# EAGLE design LoRa Mini Dev v1.3 (EAGLE 7.5.0)
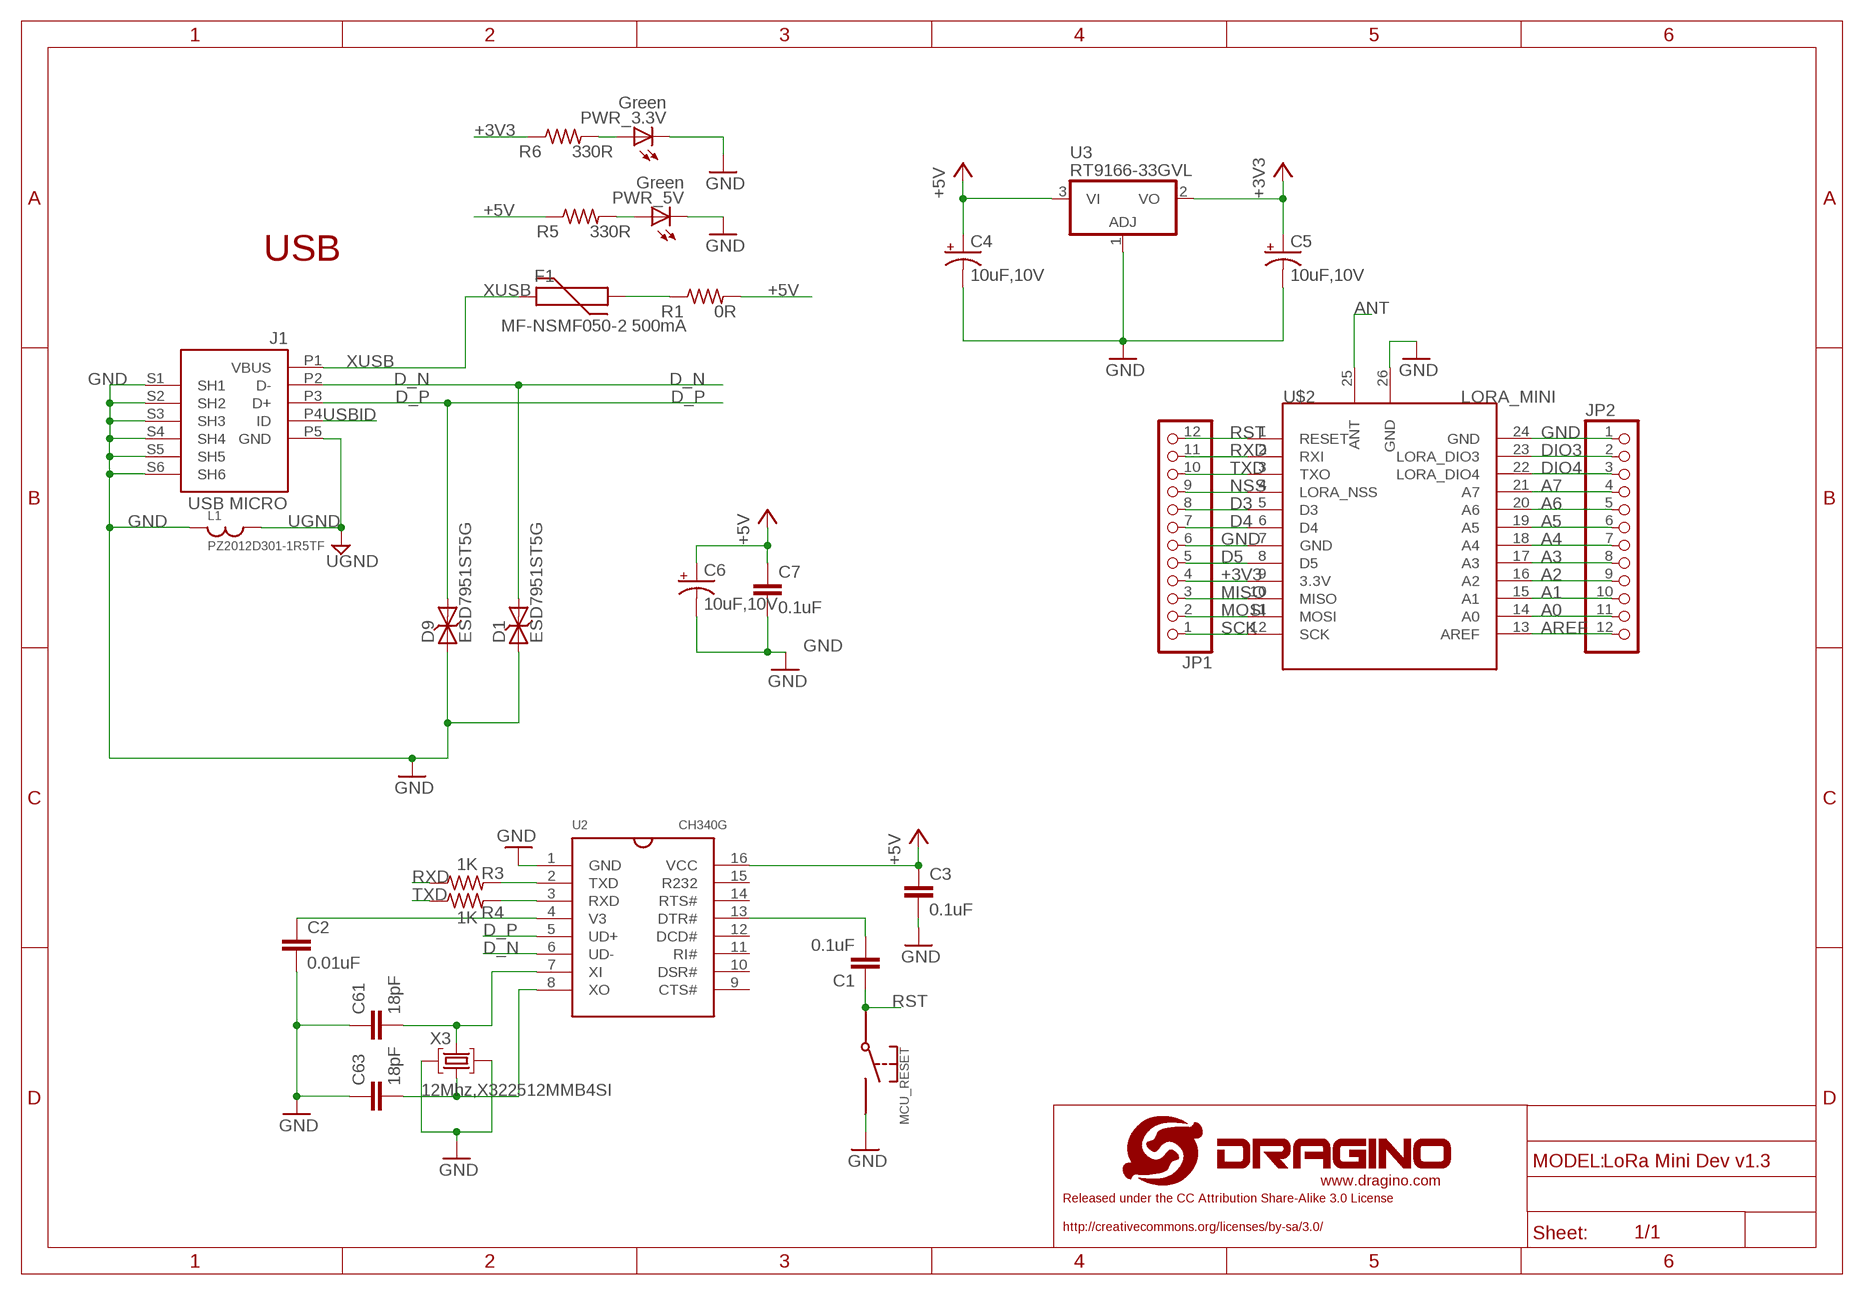
[diagram p0: schematic, sheet 1]

## Parts
C1  0.1uF  C-EUC0402  [C0402]
C2  0.01uF  C-EUC0402  [C0402]
C3  0.1uF  C-EUC0402  [C0402]
C4  10uF,10V  CPOL-USSMCA  [SMC_A]
C5  10uF,10V  CPOL-USSMCA  [SMC_A]
C6  10uF,10V  CPOL-USSMCA  [SMC_A]
C7  0.1uF  C-EUC0402  [C0402]
C61  18pF  C-EUC0402  [C0402]
C63  18pF  C-EUC0402  [C0402]
D1  ESD7951ST5G  TVSSOD−923  [SOD−923]
D9  ESD7951ST5G  TVSSOD−923  [SOD−923]
F1  MF-NSMF050-2 500mA  FUSE1206  [R1206]
J1  USB MICRO  MYCON2_USB-MINI-B  [CON2_USB_MICRO_B_AT]
JP1  PINHD-1X12  [1X12]
JP2  PINHD-1X12  [1X12]
L1  PZ2012D301-1R5TF  BEADS0805  [C0805]
MCU_RESET  SWITCH  [SWITCH_3X6X5MM]
PWR_3.3V  Green  DRAGINO_LEDCHIPLED_0603  [DRAGINO_CHIPLED_0603]
PWR_5V  Green  DRAGINO_LEDCHIPLED_0603  [DRAGINO_CHIPLED_0603]
R1  0R  R-US_R0805  [R0805]
R3  1K  R-US_R0402  [R0402]
R4  1K  R-US_R0402  [R0402]
R5  330R  R-US_R0402  [R0402]
R6  330R  R-US_R0402  [R0402]
U2  CH340G  [CH340G]
U3  RT9166-33GVL  RT9166/A  [SOT23]
U$1  LOGO-NEW  [LOGO-SILK-NEW]
U$2  LORA_MINI  LORA_MINIB  [LORA_MINI_PCB]
X3  12Mhz,X322512MMB4SI  CRYSTAL  [SMARTPRJ_CRYSTAL-3.2-2.5]

## Nets
+3V3: C5.+ JP1.4 R6.1 U3.2(VO) U$2.9(3.3V)
+5V: C3.1 C4.+ C6.+ C7.1 R1.2 R5.1 U2.16(VCC) U3.3(VI)
A0: JP2.11 U$2.14(A0)
A1: JP2.10 U$2.15(A1)
A2: JP2.9 U$2.16(A2)
A3: JP2.8 U$2.17(A3)
A4: JP2.7 U$2.18(A4)
A5: JP2.6 U$2.19(A5)
A6: JP2.5 U$2.20(A6)
A7: JP2.4 U$2.21(A7)
ANT: U$2.25(ANT)
AREF: JP2.12 U$2.13(AREF)
CLK_N: C63.2 U2.8(XO) X3.1(C1)
CLK_P: C61.2 U2.7(XI) X3.3(C2)
D3: JP1.8 U$2.5(D3)
D4: JP1.7 U$2.6(D4)
D5: JP1.5 U$2.8(D5)
D_N: D1.P$2 J1.P2(D-) U2.6(UD-)
D_P: D9.P$2 J1.P3(D+) U2.5(UD+)
DIO3: JP2.2 U$2.23(LORA_DIO3)
DIO4: JP2.3 U$2.22(LORA_DIO4)
DTR: C1.2 U2.13(DTR#)
GND [gnd]: C2.2 C3.2 C4.- C5.- C6.- C7.2 C61.1 C63.1 D1.P$1 D9.P$1 J1.S1(SH1) J1.S2(SH2) J1.S3(SH3) J1.S4(SH4) J1.S5(SH5) J1.S6(SH6) JP1.6 JP2.1 L1.1 MCU_RESET.P$2 PWR_3.3V.C PWR_5V.C U2.1(GND) U3.1(ADJ) U$2.7(GND) U$2.24(GND) U$2.26(GND) X3.2(GND) X3.4(GND)
MISO: JP1.3 U$2.10(MISO)
MOSI: JP1.2 U$2.11(MOSI)
N$1: PWR_3.3V.A R6.2
N$2: F1.1 R1.1
N$5: R3.2 U2.2(TXD)
N$8: R4.2 U2.3(RXD)
N$9: PWR_5V.A R5.2
N$10: C2.1 U2.4(V3)
NSS: JP1.9 U$2.4(LORA_NSS)
RST: C1.1 JP1.12 MCU_RESET.P$1 U$2.1(RESET)
RXD: JP1.11 R3.1 U$2.2(RXI)
SCK: JP1.1 U$2.12(SCK)
TXD: JP1.10 R4.1 U$2.3(TXO)
UGND [gnd]: J1.P5(GND) L1.2
USBID: J1.P4(ID)
XUSB [usbvcc]: F1.2 J1.P1(VBUS)
Unconnected: U2.9(CTS#) U2.10(DSR#) U2.11(RI#) U2.12(DCD#) U2.14(RTS#) U2.15(R232)

## Notes on the sheet
- USB

## Library data of the parts
C1-C3 C7 C61 C63 = dragino-passive:C-EU: CAPACITOR, European symbol
C4-C6 = rcl:CPOL-US: POLARIZED CAPACITOR, American symbol
D1 D9 = dragino:TVS: DIODE
F1 = dragino:FUSE: FUSE 5 x 20 mm
J1 = SmartPrj:MYCON2_USB-MINI-B
JP1 JP2 = pinhead:PINHD-1X12: PIN HEADER
L1 = dragino:BEADS
MCU_RESET = dragino:SWITCH
PWR_3.3V PWR_5V = Lora Shield v1.1.1:DRAGINO_LED: LED OSRAM: - CHIPLED LG R971, LG N971, LY N971, LG Q971, LY Q971, LO R971, LY R971 LH N974, LH R974 LS Q976, LO Q976, LY Q976 LO Q996 - Hyper CHIPLED LW Q18S LB Q993, LB Q99A, LB R99A - SideLED LS A670, LO A670, LY A670, LG A670, LP A670 LB A673, LV A673, LT A673, LW A673 LH A674 LY A675 LS A676, LA A676, LO A676, LY A676, LW A676 LS A679, LY A679, LG A679 - Hyper Micro SIDELED? LS Y876, LA Y876, LO Y876, LY Y876 LT Y87S - SmartLED LW L88C, LW L88S LB L89C, LB L89S, LG L890 LS L89K, LO L89K, LY L89K LS L896, LA L896, LO L896, LY L896 - TOPLED LS T670, LO T670, LY T670, LG T670, LP T670 LSG T670, LSP T670, LSY T670, LOP T670, LYG T670 LG T671, LOG T671, LSG T671 LB T673, LV T673, LT T673, LW T673 LH T674 LS T676, LA T676, LO T676, LY T676, LB T676, LH T676, LSB T676, LW T676 LB T67C, LV T67C, LT T67C, LS T67K, LO T67K, LY T67K, LW E67C LS E67B, LA E67B, LO E67B, LY E67B, LB E67C, LV E67C, LT E67C LW T67C LS T679, LY T679, LG T679 LS T770, LO T770, LY T770, LG T770, LP T770 LB T773, LV T773, LT T773, LW T773 LH T774 LS E675, LA E675, LY E675, LS T675 LS T776, LA T776, LO T776, LY T776, LB T776 LHGB T686 LT T68C, LB T68C - Hyper Mini TOPLED? LB M676 - Mini TOPLED Santana? LG M470 LS M47K, LO M47K, LY M47K Source: http://www.osram.convergy.de LUXEON: - LUMILED? LXK2-PW12-R00, LXK2-PW12-S00, LXK2-PW14-U00, LXK2-PW14-V00 LXK2-PM12-R00, LXK2-PM12-S00, LXK2-PM14-U00 LXK2-PE12-Q00, LXK2-PE12-R00, LXK2-PE12-S00, LXK2-PE14-T00, LXK2-PE14-U00 LXK2-PB12-K00, LXK2-PB12-L00, LXK2-PB12-M00, LXK2-PB14-N00, LXK2-PB14-P00, LXK2-PB14-Q00 LXK2-PR12-L00, LXK2-PR12-M00, LXK2-PR14-Q00, LXK2-PR14-R00 LXK2-PD12-Q00, LXK2-PD12-R00, LXK2-PD12-S00 LXK2-PH12-R00, LXK2-PH12-S00 LXK2-PL12-P00, LXK2-PL12-Q00, LXK2-PL12-R00 Source: www.luxeon.com KINGBRIGHT: KA-3528ASYC Source: www.kingbright.com
R1 R3-R6 = dragino:R-US_: RESISTOR, American symbol
U2 = dragino:CH340G
U3 = linear:RT9166/A
U$1 = dragino:LOGO-NEW
U$2 = dragino:LORA_MINI
X3 = dragino-passive:CRYSTAL

## Net classes
0 default: clearance 0.205 mm
1 2layer-50ohm: width 1 mm, clearance 0.2 mm
2 gnd: width 0.305 mm, drill 0.254 mm, clearance 0.203 mm
3 usbvcc: width 0.254 mm, drill 0.61 mm, clearance 0.254 mm
5 usbtrace: width 0.254 mm, clearance 0.152 mm
6 usbtrace-4layer: width 0.191 mm, clearance 0.203 mm

## Board
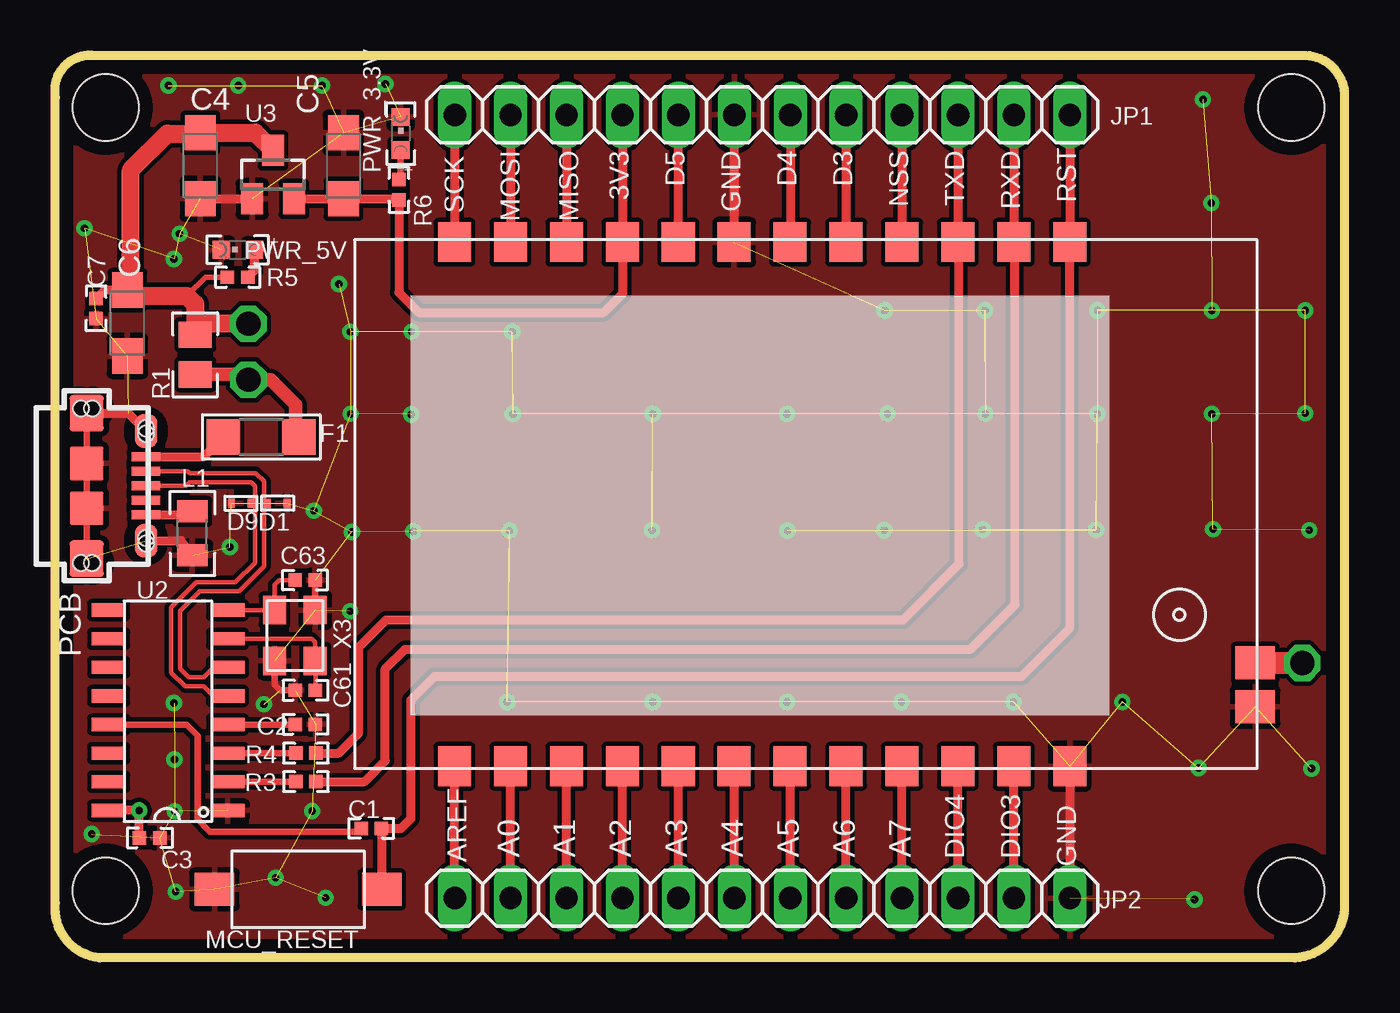
[diagram p1: board, top side]
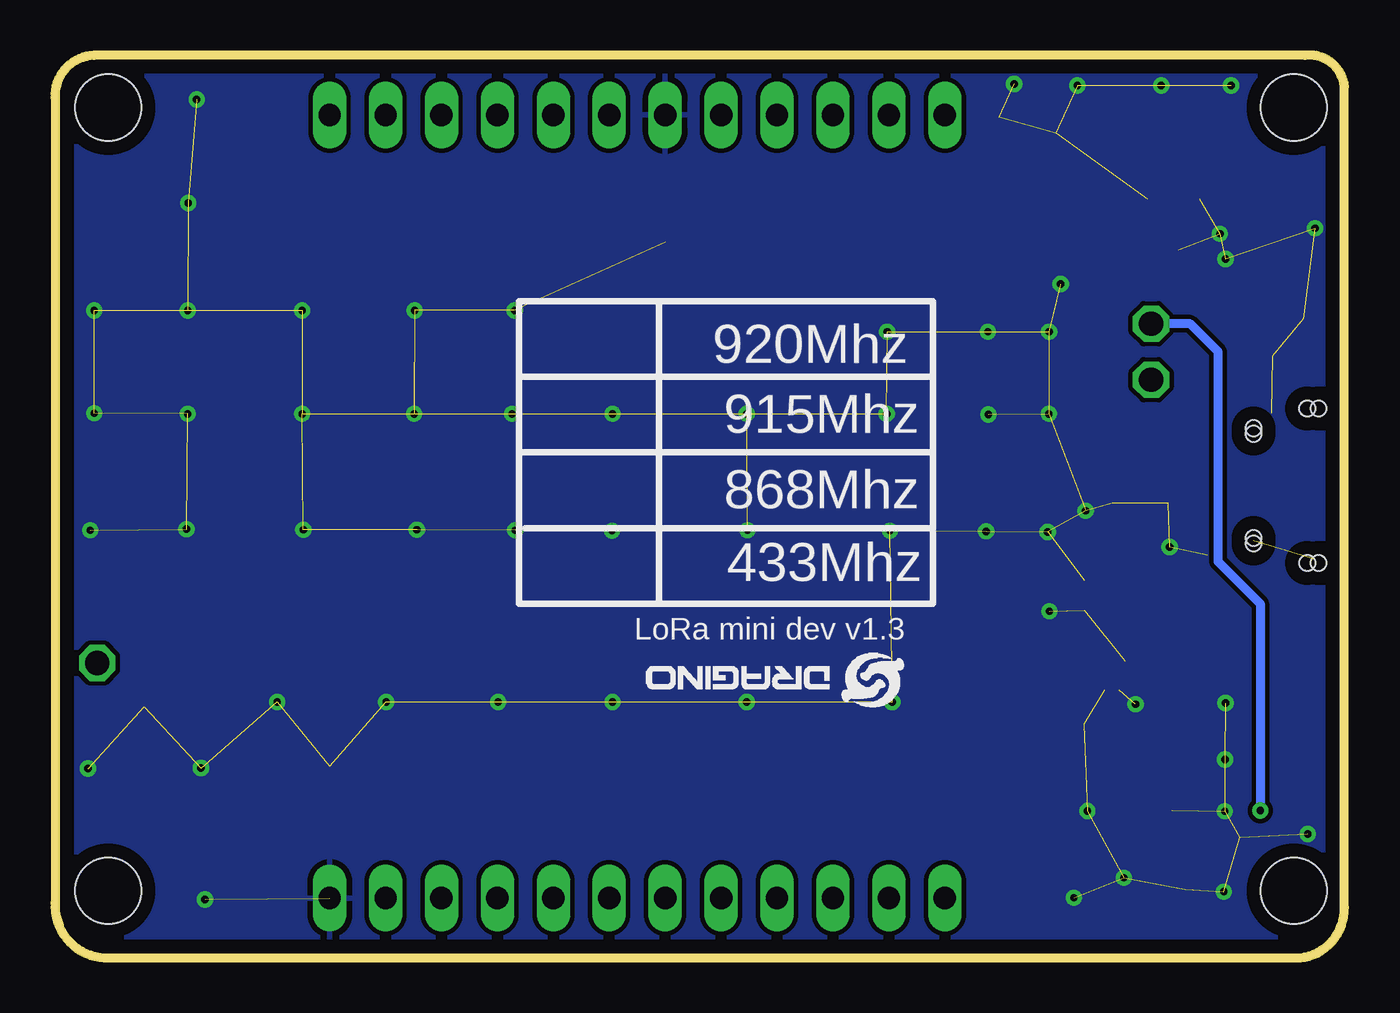
[diagram p2: board, bottom side, seen from below]

Size 58.57 x 40.99 mm. Coordinates in mm from the lower left corner, seen from the top.
Outline: 0.02,39.08 0,39.57 arc-90 1.8,40.98 56.81,40.98 arc-90 58.56,39.08 58.56,2.5 arc-90 56.32,0 2.01,0 arc-90 0.02,2.5 0.02,39.08
Copper layers (1*16): Top 0.035mm / dielectric 1.5mm / Bottom 0.035mm
Design rules "default *": minimum track width 8mil, minimum drill 12mil, track to track 8mil, track to pad 8mil, pad to pad 8mil, via to via 10mil, smd to smd 8mil, copper to edge 25mil, drill to drill 8mil, minimum pad ring 10mil, minimum via ring 8mil, stop-mask expansion 1mil, vias tented up to drill 30mil, thermal gap 10mil
Holes 3 mm at 56.15,3.05 56.15,38.61 2.3,3.05 2.3,38.61

### Footprints (pad centres in the part's own frame; a part is rotated, then mirrored left to right if it is on the bottom)
C0402 = smd 0.61 x 0.61: 1 -0.457,0; 2 0.457,0
SMC_A = smd 1.6 x 1.4: + -1.5,0; - 1.5,0
SOD−923 = smd 0.3 x 0.4: P$1 -0.45,0; P$2 0.45,0
R1206 = smd 1.52 x 1.6: 1 -1.71,0; 2 1.71,0
CON2_USB_MICRO_B_AT = smd 0.406 x 1.346: P1 -1.321,2.692; P2 -0.66,2.692; P3 0,2.692; P4 0.66,2.692; P5 1.321,2.692 | smd 1.651 x 1.549: S1 -3.302,0; S2 3.302,0 | smd 1.524 x 1.016: S3 -2.489,2.692; S4 2.489,2.692 | smd 1.524 x 1.524: S5 -1.016,0; S6 1.016,0 | hole 0.7: -3.505,0.254; -3.505,-0.254; 3.505,0.254; 3.505,-0.254; -2.616,2.692; -2.362,2.692; 2.362,2.692; 2.616,2.692
1X12 = drill 1.016 long: 1 -13.97,0; 2 -11.43,0; 3 -8.89,0; 4 -6.35,0; 5 -3.81,0; 6 -1.27,0; 7 1.27,0; 8 3.81,0; 9 6.35,0; 10 8.89,0; 11 11.43,0; 12 13.97,0
C0805 = smd 1 x 1.4: 1 -1,0; 2 1,0
SWITCH_3X6X5MM = smd 1.8 x 1.5: P$1 -3.8,0; P$2 3.8,0
DRAGINO_CHIPLED_0603 = smd 0.8 x 0.8: A 0,-0.75; C 0,0.75
R0805 = smd 1.2 x 1.5: 1 -0.9,0; 2 0.9,0
R0402 = smd 0.61 x 0.61: 1 -0.457,0; 2 0.457,0
CH340G = smd 1.55 x 0.6: 1 -2.7,4.5; 2 -2.7,3.2; 3 -2.7,1.9; 4 -2.7,0.6; 5 -2.7,-0.7; 6 -2.7,-2; 7 -2.7,-3.3; 8 -2.7,-4.6; 9 2.7,-4.6; 10 2.7,-3.3; 11 2.7,-2; 12 2.7,-0.7; 13 2.7,0.6; 14 2.7,1.9; 15 2.7,3.2; 16 2.7,4.5
SOT23 = smd 1 x 1.4: 1 -0.95,-1.1; 2 0.95,-1.1; 3 0,1.1
LORA_MINI_PCB = smd 1.8 x 1.5: 1 0.1,32.48; 2 0.1,29.94; 3 0.1,27.4; 4 0.1,24.86; 5 0.1,22.32; 6 0.1,19.78; 7 0.1,17.24; 8 0.1,14.7; 9 0.1,12.16; 10 0.1,9.62; 11 0.1,7.08; 12 0.1,4.54; 13 23.9,4.54; 14 23.9,7.08; 15 23.9,9.62; 16 23.9,12.16; 17 23.9,14.7; 18 23.9,17.24; 19 23.9,19.78; 20 23.9,22.32; 21 23.9,24.86; 22 23.9,27.4; 23 23.9,29.94; 24 23.9,32.48 | smd 1.5 x 1.8: 25 19.2,40.9; 26 21.2,40.9
SMARTPRJ_CRYSTAL-3.2-2.5 = smd 1.3 x 1.05: 1 -1.15,-0.925; 2 1.15,-0.925; 3 1.15,0.925; 4 -1.15,0.925

### Placement (x,y rotation side)
C1  14.37,5.88 180 top
C2  11.37,10.6 0 top
C3  4.3,5.45 0 top
C4  6.6,35.97 270 top
C5  13.1,35.97 90 top
C6  3.29,28.83 270 top
C7  1.87,29.48 270 top
C61  11.37,12.15 0 top
C63  11.36,17.15 180 top
D1  10.09,20.64 180 top
D9  8.46,20.64 0 top
F1  9.37,23.65 180 top
J1  1.44,21.43 270 top
JP1  32.12,38.28 0 top
JP2  32.12,2.71 180 top
L1  6.24,19.28 90 top
MCU_RESET  11.04,3.11 180 top
PWR_3.3V  15.7,37.43 0 top
PWR_5V  8.3,32.15 90 top
R1  6.37,27.39 90 top
R3  11.4,8.01 180 top
R4  11.39,9.3 180 top
R5  8.3,30.91 0 top
R6  15.62,34.88 90 top
U2  5.14,11.19 180 top
U3  9.9,35.56 0 top
U$1  20,13.84 180 bottom
U$2  13.61,32.6 270 top
X3  10.89,14.64 270 top

### Tracks (layer width: path | path; a pad name or v marks a point on that pad's centre or on a via)
+3V3
  Top 0.406: U3.2 13.31,34.46 | 13.31,34.46 15.58,34.46 R6.1 15.62,30.21 16.53,29.3 24.91,29.3 25.8,30.19 25.8,32.47 U$2.9 JP1.4 | C5.+ 13.3,34.47 13.31,34.46
+5V  (via drill 0.33, 1.1)
  Top 0.254: R5.1 6.83,30.91 5.99,30.06
  Top 0.406: 3.55,30.06 C6.+ | C6.+ 2.25,30.33 C7.1 | 3.45,30.49 C6.+ | 6.16,37.47 C4.+ | U2.16 v3.83,6.69 3.83,5.47 C3.1
  Top 0.813: 3.55,30.06 5.99,30.06 6.37,29.68 R1.2 6.86,28.79 v8.78,28.79 | 3.45,30.49 3.45,35.78 5.1,37.43 6.56,37.43 C4.+ 9.1,37.47 U3.3
  Bottom 0.406: v8.78,28.79 7,28.79 5.73,27.52 5.73,18 3.83,16.09 v3.83,6.69
A0
  Top 0.406: JP2.11 U$2.14
A1
  Top 0.406: JP2.10 U$2.15
A2
  Top 0.406: JP2.9 U$2.16
A3
  Top 0.406: JP2.8 U$2.17
A4
  Top 0.406: JP2.7 U$2.18
A5
  Top 0.406: JP2.6 U$2.19
A6
  Top 0.406: JP2.5 U$2.20
A7
  Top 0.406: JP2.4 U$2.21
ANT  (via drill 1.09)
  Top 1: U$2.25 56.25,13.4 v56.65,13.39
AREF
  Top 0.406: JP2.12 U$2.13
CLK_N
  Top 0.203: C63.2 10.18,17.16 9.97,16.95 X3.1 U2.8
CLK_P
  Top 0.203: U2.7 11.65,14.49 11.8,14.34 11.8,13.51 X3.3 C61.2
D3
  Top 0.406: JP1.8 U$2.5
D4
  Top 0.406: JP1.7 U$2.6
D5
  Top 0.406: U$2.8 JP1.5
D_N
  Top 0.203: J1.P2 6.03,22.1 6.11,22.01 9.12,22.01 9.49,21.64 9.49,20.76 | 9.49,20.76 9.49,17.78 8.36,16.65 6.58,16.65 5.68,15.75 5.68,13.13 6.07,12.74 6.75,12.74 7.2,13.19 U2.6 | D1.P$2 9.61,20.64 9.49,20.76
D_P
  Top 0.203: J1.P3 5.95,21.43 6.11,21.6 8.91,21.6 9.08,21.43 9.08,20.56 | U2.5 7.18,11.89 6.75,12.33 5.9,12.33 5.27,12.96 5.27,15.92 6.41,17.06 8.19,17.06 9.08,17.95 9.08,20.56 | D9.P$2 9.01,20.64 9.08,20.56
DIO3
  Top 0.406: JP2.2 U$2.23
DIO4
  Top 0.406: JP2.3 U$2.22
DTR
  Top 0.305: U2.13 5.97,10.59 6.47,10.1 6.47,6.29 7.03,5.73 13.76,5.73 C1.2
GND  (via drill 0.33)  (77 unrouted)
  Top 0.305: J1.S2 J1.S6 J1.S5 J1.S1 | X3.2 9.97,12.41 10.23,12.15 C61.1 | X3.4 C63.1
  Top 0.406: C4.- U3.1 | J1.S1 3.32,24.74 J1.S3 | J1.S4 5.72,18.95 L1.1 | U$2.24 46.09,3.38 46.04,3.34 46.04,2.77 JP2.1 | U$2.7 JP1.6
  other vias: 10.02,3.64 11.68,6.67 15.01,39.68 13.42,28.43 12.13,39.61 8.32,39.61 5.15,39.61 20.77,28.43 12.89,30.59 16.2,28.43 13.48,19.34 16.27,19.37 56.79,24.73 13.4,15.73 1.67,5.63 5.48,3.01 12.29,2.73 5.4,11.57 9.49,11.52 5.43,9 5.43,6.65 48.48,11.62 43.53,11.62 38.45,11.62 33.24,11.62 27.14,11.62 52.54,24.7 52.59,19.47 47.34,24.7 42.13,19.44 37.81,24.7 33.27,19.39 33.24,24.7 27.12,19.42 27.14,24.7 20.64,19.39 20.79,24.7 13.43,24.7 16.17,24.68 42.26,24.7 37.66,19.42 7.94,18.66 11.75,20.31 5.4,31.74 5.66,32.88 37.69,29.4 42.23,29.4 47.34,29.4 52.54,29.4 56.79,29.4 20.54,11.62 47.29,19.44 56.96,19.42 52.52,34.28 52.14,38.98 1.34,33.13 51.93,8.62 51.76,2.65 57.07,8.6
  pour Top: 58.84,41.36 59.02,-0.42 -0.49,-0.04 -0.47,41.34
  pour Bottom: -0.47,41.31 58.84,41.36 58.97,-0.42 -0.49,-0.04
MISO
  Top 0.406: JP1.3 U$2.10
MOSI
  Top 0.406: JP1.2 U$2.11
N$1
  Top 0.305: R6.2 15.7,35.34 PWR_3.3V.A
N$2  (via drill 1.1)
  Top 0.61: R1.1 8.54,26.49 v8.78,26.25 9.8,26.25 10.94,25.11 10.94,23.79 F1.1
N$5
  Top 0.305: U2.2 10.93,7.99 R3.2
N$8
  Top 0.305: U2.3 R4.2
N$9
  Top 0.406: PWR_5V.A 9.05,31.2 R5.2
N$10
  Top 0.305: U2.4 10.91,10.59 C2.1
NSS
  Top 0.406: JP1.9 U$2.4
RST
  Top 0.406: JP1.12 U$2.1 46.09,14.97 43.91,12.79 17.24,12.79 16.17,11.72 16.17,6.34 15.71,5.88 C1.1 14.83,3.13 MCU_RESET.P$1
RXD
  Top 0.406: JP1.11 U$2.2 43.6,32.44 43.6,16.04 41.57,14.01 15.89,14.01 15,13.12 15,8.95 14.06,8.01 R3.1
SCK
  Top 0.406: JP1.1 U$2.12
TXD
  Top 0.406: JP1.10 41.01,33.06 | 41.01,33.06 41.01,32.91 40.51,32.4 40.9,32.4 U$2.3 | R4.1 12.89,9.3 13.78,10.2 13.78,14.11 15.03,15.35 38.52,15.35 41.06,17.89 41.06,33.01 41.01,33.06
UGND
  Top 0.406: J1.P5 6.23,20.11 L1.2
XUSB
  Top 0.406: J1.P1 6.76,22.76 F1.2

### Text on the board
tPlace: SCK | MOSI | MISO | 3V3 | D5 | GND | D4 | D3 | NSS | TXD | RXD | RST | AREF | DIO4 | DIO3 | A0 | A1 | A2 | A3 | A4 | A5 | A6 | A7 | GND
bPlace: 920Mhz | 915Mhz | 868Mhz | 433Mhz | LoRa mini dev v1.3